# EAGLE design Serial_Controlled_Dual_Motor_Driver-v12 (EAGLE 7.2.0)
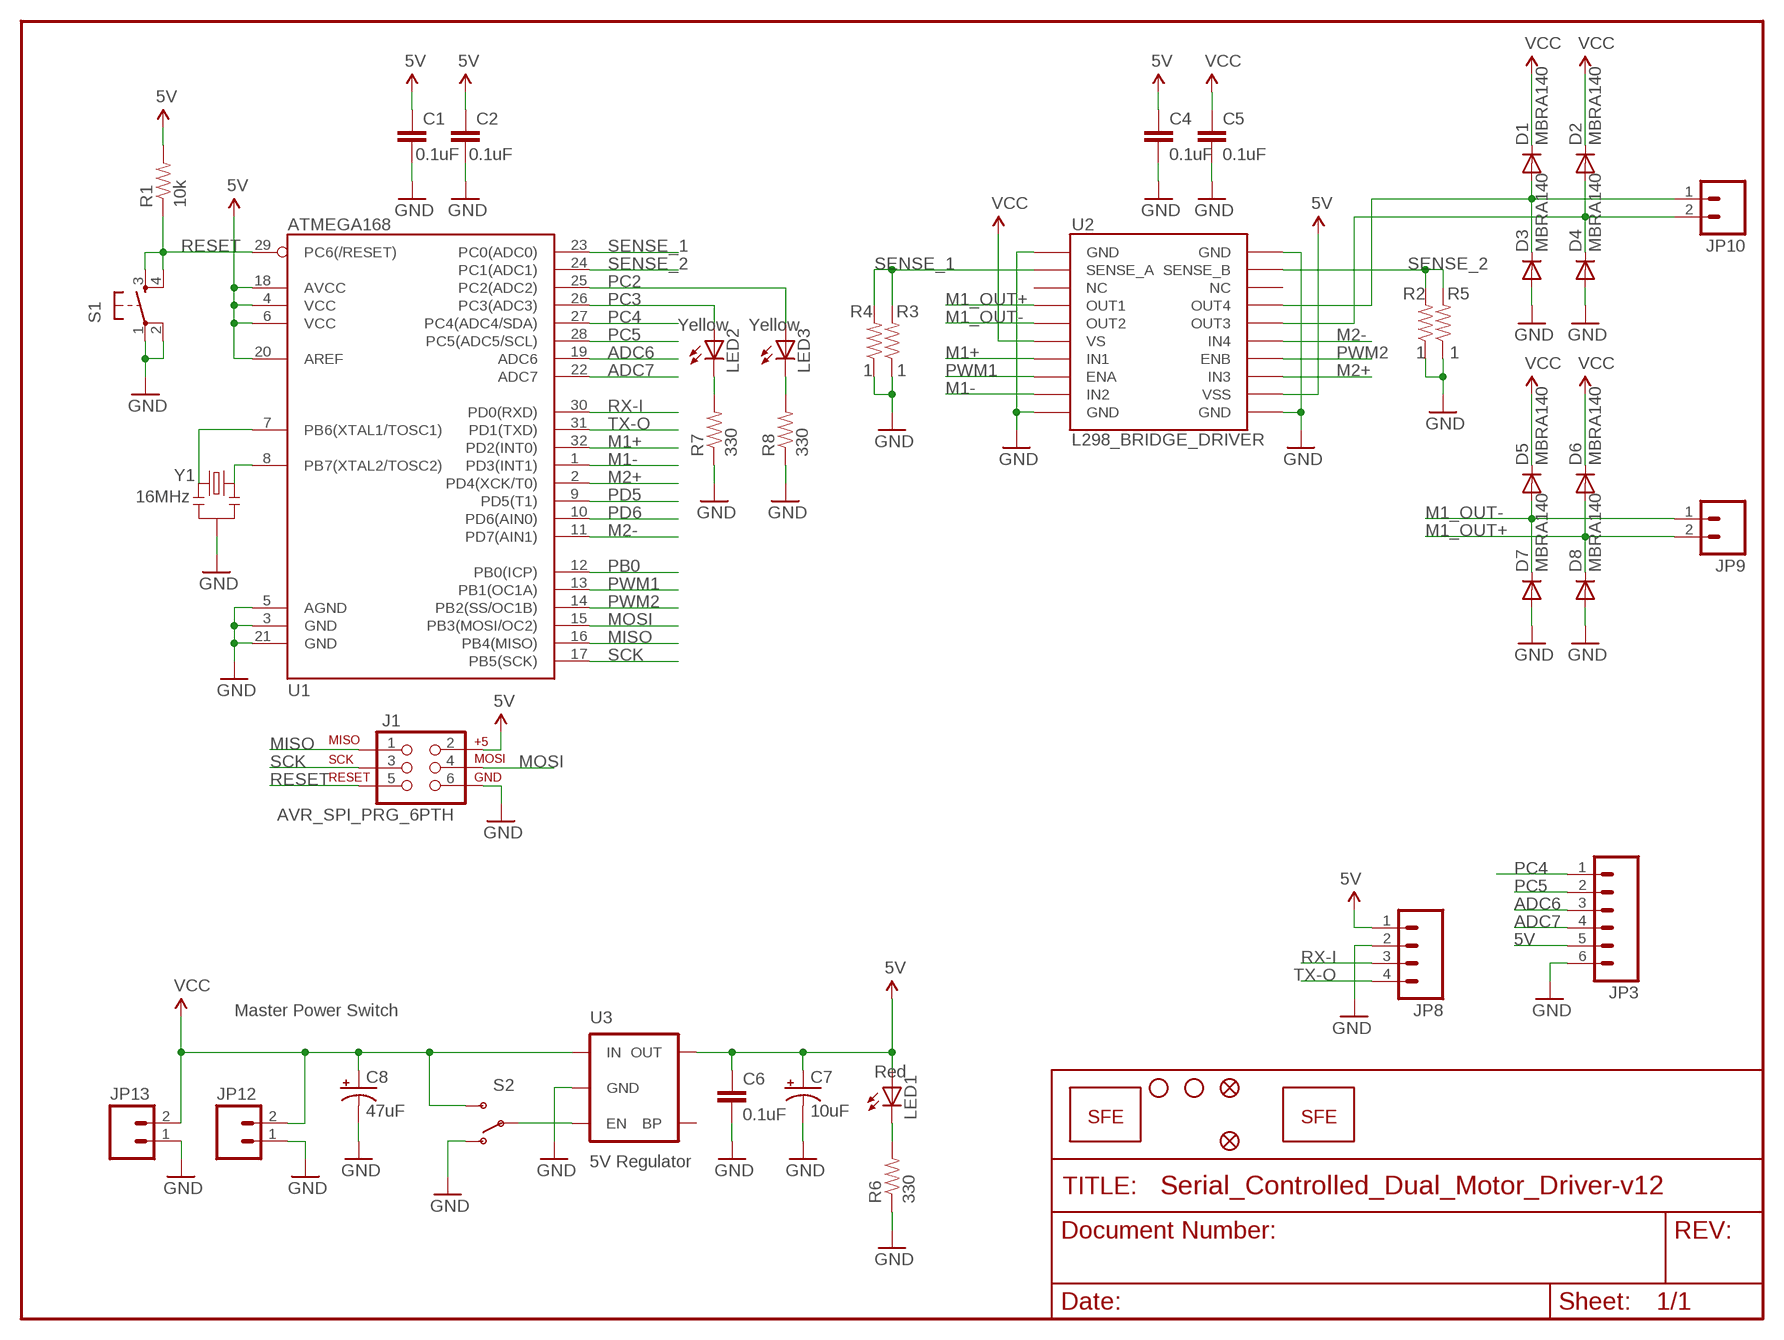
[diagram p0: schematic, sheet 1]

## Parts
C1  0.1uF  CAP0603-CAP  [0603-CAP]
C2  0.1uF  CAP0603-CAP  [0603-CAP]
C4  0.1uF  CAP0603-CAP  [0603-CAP]
C5  0.1uF  CAP0603-CAP  [0603-CAP]
C6  0.1uF  CAP0603-CAP  [0603-CAP]
C7  10uF  CAP_POL1206  [EIA3216]
C8  47uF  CAP_POL3528  [EIA3528]
D1  MBRA140  DIODESMA  [SMA-DIODE]
D2  MBRA140  DIODESMA  [SMA-DIODE]
D3  MBRA140  DIODESMA  [SMA-DIODE]
D4  MBRA140  DIODESMA  [SMA-DIODE]
D5  MBRA140  DIODESMA  [SMA-DIODE]
D6  MBRA140  DIODESMA  [SMA-DIODE]
D7  MBRA140  DIODESMA  [SMA-DIODE]
D8  MBRA140  DIODESMA  [SMA-DIODE]
J1  AVR_SPI_PRG_6PTH  [2X3]
JP1  LOGO-SFENEW  [SFE-NEW-WEBLOGO]
JP2  STAND-OFF  [STAND-OFF]
JP3  M06SIP  [1X06]
JP4  FIDUCIAL1X2  [FIDUCIAL-1X2]
JP5  FIDUCIAL1X2  [FIDUCIAL-1X2]
JP6  STAND-OFF  [STAND-OFF]
JP7  LOGO-SFESK  [SFE-LOGO-FLAME]
JP8  M04PTH  [1X04]
JP9  M02PTH  [1X02]
JP10  M02PTH  [1X02]
JP12  M02-JST-2MM-SMT  [S2B-PH]
JP13  M02PTH  [1X02]
LED1  Red  LED0603  [LED-0603]
LED2  Yellow  LED0603  [LED-0603]
LED3  Yellow  LED0603  [LED-0603]
R1  10k  RESISTOR0603-RES  [0603-RES]
R2  1  RESISTOR0603-RES  [0603-RES]
R3  1  RESISTOR0603-RES  [0603-RES]
R4  1  RESISTOR0603-RES  [0603-RES]
R5  1  RESISTOR0603-RES  [0603-RES]
R6  330  RESISTOR0603-RES  [0603-RES]
R7  330  RESISTOR0603-RES  [0603-RES]
R8  330  RESISTOR0603-RES  [0603-RES]
S1  TAC_SWITCHSMD  [TACTILE_SWITCH_SMD]
S2  SWITCH-SPSTSMD  [AYZ0202]
U1  ATMEGA168  [TQFP32-08]
U2  L298_BRIDGE_DRIVER  [POWERSO20]
U3  5V Regulator  V_REG_LDOSMD  [SOT23-5]
Y1  16MHz  RESONATORSMD  [RESONATOR-SMD]

## Nets
5V: C1.1 C2.1 C4.1 C6.1 C7.A(+) J1.2 JP3.5 JP8.1 LED1.A R1.2 U1.4(VCC) U1.6(VCC) U1.18(AVCC) U1.20(AREF) U2.P$12(VSS) U3.5(OUT)
ADC6: JP3.3 U1.19(ADC6)
ADC7: JP3.4 U1.22(ADC7)
GND: C1.2 C2.2 C4.2 C5.2 C6.2 C7.C(-) C8.C(-) D3.A D4.A D7.A D8.A J1.6 JP3.6 JP8.2 JP12.1 JP13.1 R2.1 R3.1 R4.1 R5.1 R6.1 R7.1 R8.1 S1.1 S1.2 S2.1(O) U1.3(GND) U1.5(AGND) U1.21(GND) U2.P$1(GND) U2.P$10(GND) U2.P$11(GND) U2.P$20(GND) U3.2(GND) Y1.2
M1+: U1.32(PD2(INT0)) U2.P$7(IN1)
M1-: U1.1(PD3(INT1)) U2.P$9(IN2)
M1_OUT+: D6.A D8.C JP9.2 U2.P$4(OUT1)
M1_OUT-: D5.A D7.C JP9.1 U2.P$5(OUT2)
M2+: U1.2(PD4(XCK/T0)) U2.P$13(IN3)
M2-: U1.11(PD7(AIN1)) U2.P$15(IN4)
M2_OUT+: D2.A D4.C JP10.2 U2.P$16(OUT3)
M2_OUT-: D1.A D3.C JP10.1 U2.P$17(OUT4)
MISO: J1.1 U1.16(PB4(MISO))
MOSI: J1.4 U1.15(PB3(MOSI/OC2))
N$1: S2.2(P) U3.3(EN)
N$2: U1.8(PB7(XTAL2/TOSC2)) Y1.3
N$3: U1.7(PB6(XTAL1/TOSC1)) Y1.1
N$4: LED2.C R7.2
N$7: LED3.C R8.2
N$97: LED1.C R6.2
PB0: U1.12(PB0(ICP))
PC2: LED3.A U1.25(PC2(ADC2))
PC3: LED2.A U1.26(PC3(ADC3))
PC4: JP3.1 U1.27(PC4(ADC4/SDA))
PC5: JP3.2 U1.28(PC5(ADC5/SCL))
PD5: U1.9(PD5(T1))
PD6: U1.10(PD6(AIN0))
PWM1: U1.13(PB1(OC1A)) U2.P$8(ENA)
PWM2: U1.14(PB2(SS/OC1B)) U2.P$14(ENB)
RESET: J1.5 R1.1 S1.3 S1.4 U1.29(PC6(/RESET))
RX-I: JP8.3 U1.30(PD0(RXD))
SCK: J1.3 U1.17(PB5(SCK))
SENSE_1: R3.2 R4.2 U1.23(PC0(ADC0)) U2.P$2(SENSE_A)
SENSE_2: R2.2 R5.2 U1.24(PC1(ADC1)) U2.P$19(SENSE_B)
TX-O: JP8.4 U1.31(PD1(TXD))
VCC: C5.1 C8.A(+) D1.C D2.C D5.C D6.C JP12.2 JP13.2 S2.3(S) U2.P$6(VS) U3.1(IN)
Unconnected: U2.P$3(NC) U2.P$18(NC) U3.4(BP)

## Notes on the sheet
- Master Power Switch

## Library data of the parts
C1 C2 C4-C6 = SparkFun:CAP: Capacitor Standard 0603 ceramic capacitor, and 0.1" leaded capacitor.
C7 C8 = SparkFun:CAP_POL: Capacitor Polarized These are standard SMD and PTH capacitors. Normally 10uF, 47uF, and 100uF in electrolytic and tantalum varieties. Always verify the external diameter of the through hole cap, it varies with capacity, voltage, and manufacturer. The EIA devices should be standard.
D1-D8 = SparkFun:DIODE: Diode These are standard reverse protection diodes and small signal diodes. SMA package can handle up to about 1A. SOD-323 can handle about 200mA. What the SOD-323 package when ordering, there are some mfgs out there that are 5-pin packages.
J1 = SparkFun:AVR_SPI_PRG_6: AVR ISP 6 Pin This is the reduced ISP connector for AVR programming. Common on Arduino. This footprint will take up less PCB space and can be used with a 10-pin to 6-pin adapter such as SKU: BOB-08508
JP1 JP7 = SparkFun:LOGO-SFE: Spark Fun Electronics PCB Logo This is the standard Spark Fun Electronics PCB logo.
JP2 JP6 = SparkFun:STAND-OFF: Stand Off This is the mechanical footprint for a #4 phillips button head screw. Use the keepout ring to avoid running the screw head into surrounding components. SKU : PRT-00447
JP3 = SparkFun:M06: Header 6 Standard 6-pin 0.1" header. Use with straight break away headers (SKU : PRT-00116), right angle break away headers (PRT-00553), swiss pins (PRT-00743), machine pins (PRT-00117), and female headers (PRT-00115). Molex polarized connector foot print use with SKU : PRT-08094 with associated crimp pins and housings. NOTES ON THE VARIANTS LOCK and LOCK_LONGPADS... This footprint was designed to help hold the alignment of a through-hole component (i.e. 6-pin header) while soldering it into place. You may notice that each hole has been shifted either up or down by 0.005 of an inch from it's more standard position (which is a perfectly straight line). This slight alteration caused the pins (the squares in the middle) to touch the edges of the holes. Because they are alternating, it causes a "brace" to hold the component in place. 0.005 has proven to be the perfect amount of "off-center" position when using our standard breakaway headers. Although looks a little odd when you look at the bare footprint, once you have a header in there, the alteration is very hard to notice. Also, if you push a header all the way into place, it is covered up entirely on the bottom side. This idea of altering the position of holes to aid alignment will be further integrated into the Sparkfun Library for other footprints. It can help hold any component with 3 or more connection pins.
JP4 JP5 = SparkFun:FIDUCIAL: Fiducial Alignment Points Various fiducial points for machine vision alignment.
JP8 = SparkFun:M04: Header 4 Standard 4-pin 0.1" header. Use with straight break away headers (SKU : PRT-00116), right angle break away headers (PRT-00553), swiss pins (PRT-00743), machine pins (PRT-00117), and female headers (PRT-00115). Molex polarized connector foot print use with SKU : PRT-08231 with associated crimp pins and housings.
JP9 JP10 JP12 JP13 = SparkFun:M02: Header 2 Standard 2-pin 0.1" header. Use with straight break away headers (SKU : PRT-00116), right angle break away headers (PRT-00553), swiss pins (PRT-00743), machine pins (PRT-00117), and female headers (PRT-00115). Molex polarized connector foot print use with SKU : PRT-08233 with associated crimp pins and housings.
LED1-LED3 = SparkFun:LED: LEDs Standard schematic elements and footprints for 5mm, 3mm, 1206, and 0603 sized LEDs. 5mm - Spark Fun Electronics SKU : COM-00529 (and others)
R1-R8 = SparkFun:RESISTOR: Resistor Basic schematic elements and footprints for 0603, 1206, and PTH 1/10th watt (small) resistors.
S1 = SparkFun:TAC_SWITCH: Momentary Switch Button commonly used for reset or general input. Spark Fun Electronics SKU : COM-00097
S2 = SparkFun:SWITCH-SPST: SPST Switch Simple slide switch. Spark Fun Electronics SKU : COM-00102
U1 = SparkFun:ATMEGA168
U2 = SparkFun:L298_BRIDGE_DRIVER
U3 = SparkFun:V_REG_LDO: Voltage Regulator LDO Standard 150mA LDO voltage regulator in SOT-23 layout. Micrel part MIC5205. BP (by-pass) pin is used to lower output noise with 470pF cap.
Y1 = SparkFun:RESONATOR: Resonator Small SMD resonator. This is the itty bitty 10/20MHz resonators with built in caps. CSTCE10M0G55 and CSTCE20M0V53. Footprint has been reviewed closely but hasn't been tested yet.

## Board
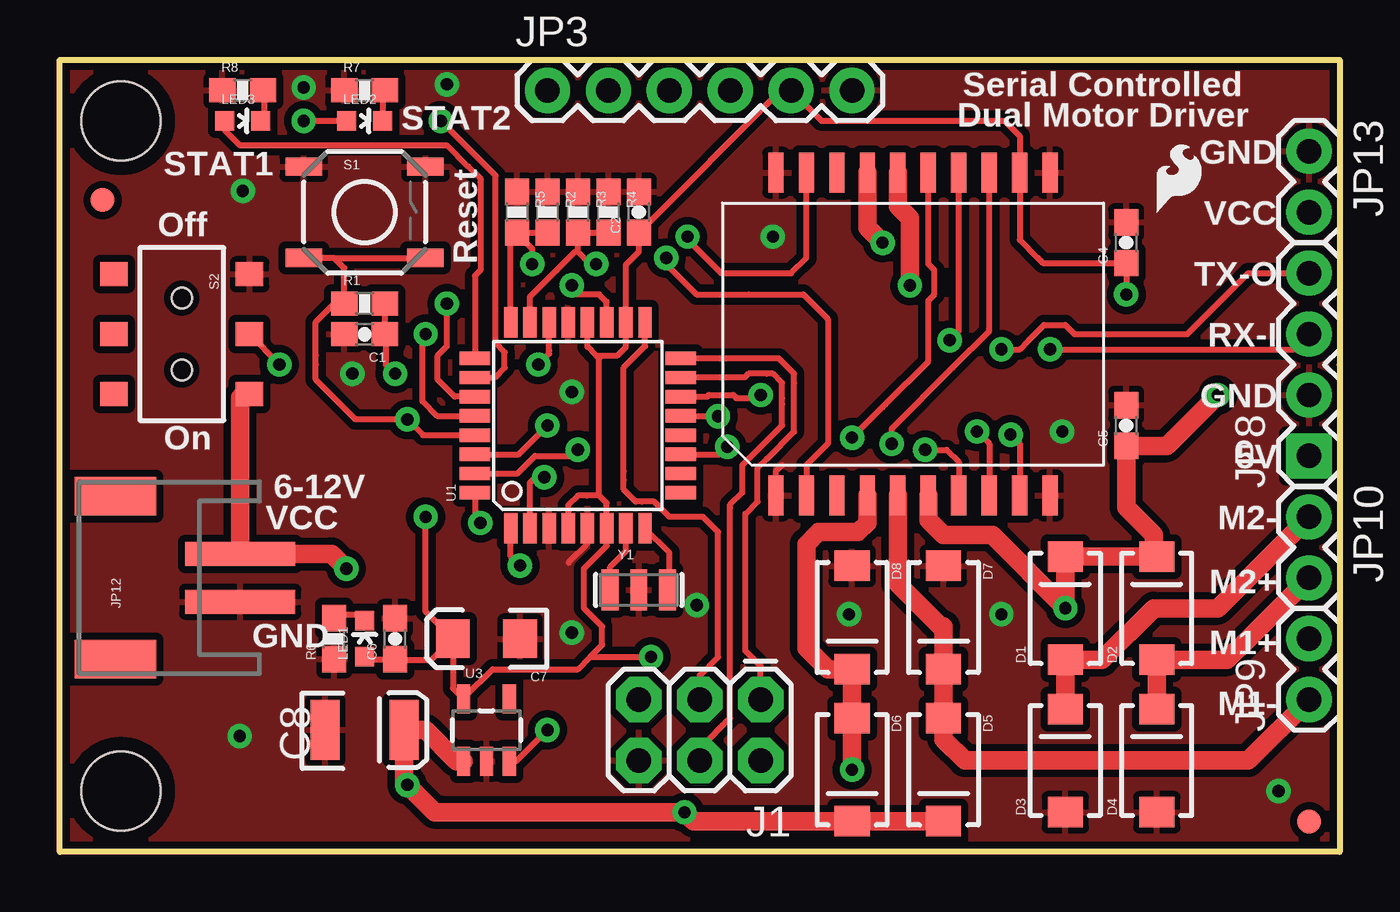
[diagram p1: board, top side]
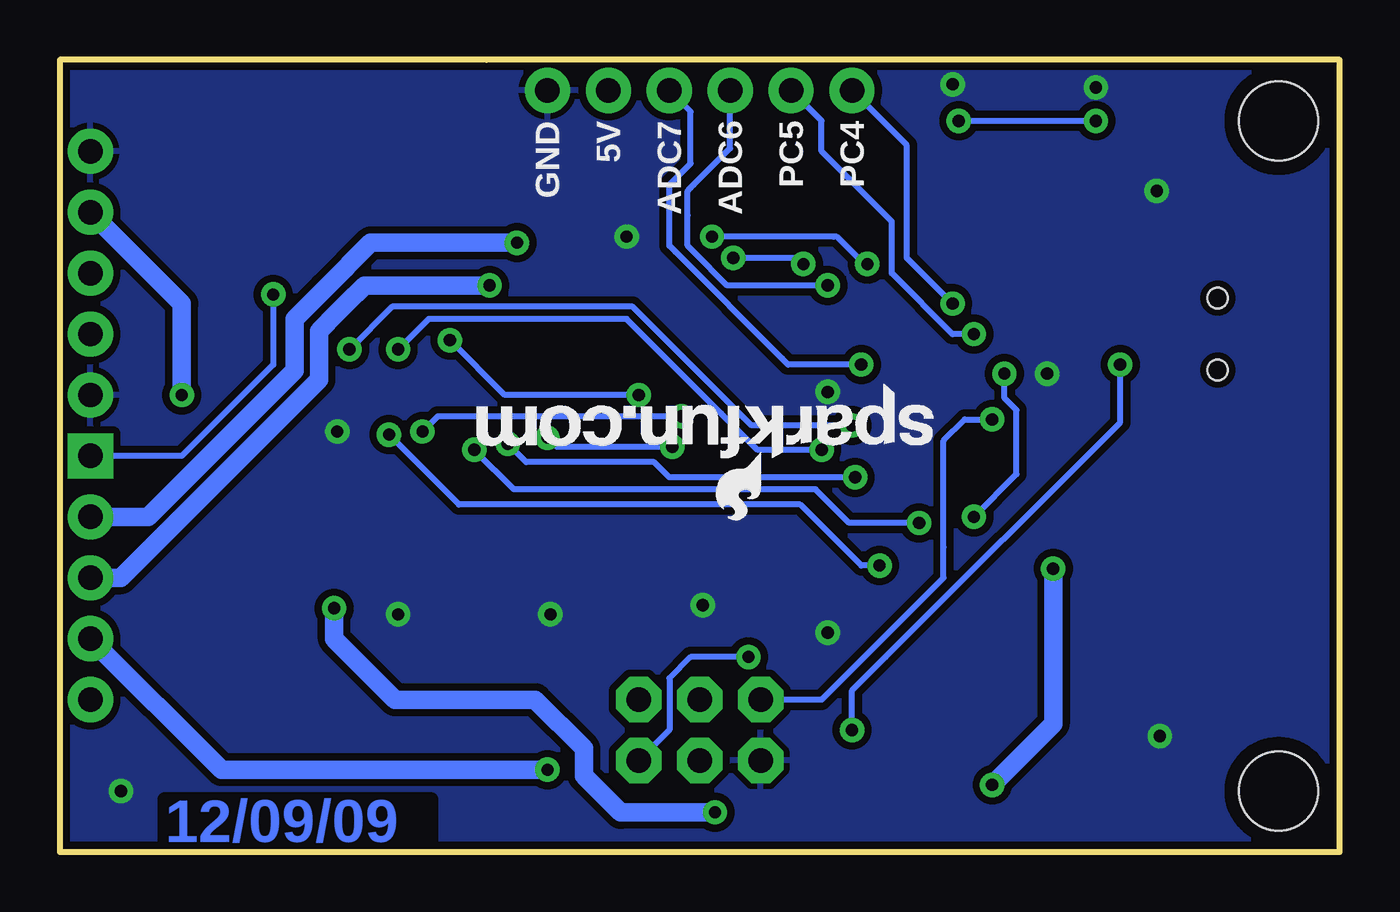
[diagram p2: board, bottom side, seen from below]

Size 53.34 x 33.02 mm. Coordinates in mm from the lower left corner, seen from the top.
Outline: 0,0 0,33.02 35.56,33.02 53.34,33.02 53.34,20.32 53.34,0 0,0
Copper layers (1*16): Top 0.035mm / dielectric 1.5mm / Bottom 0.035mm
Design rules "SparkFun *": minimum track width 8mil, minimum drill 20mil, track to track 8mil, track to pad 8mil, pad to pad 8mil, via to via 8mil, smd to smd 8mil, copper to edge 9mil, drill to drill 8mil, minimum pad ring 12mil, minimum via ring 10mil, stop-mask expansion 4mil, vias tented up to drill 20mil, thermal gap 10mil

### Footprints (pad centres in the part's own frame; a part is rotated, then mirrored left to right if it is on the bottom)
0603-CAP = smd 1.1 x 1: 1 -0.85,0; 2 0.85,0
EIA3216 = smd 1.4 x 1.6: A 1.4,0; C -1.4,0
EIA3528 = smd 1.2 x 2.5: A 1.65,0; C -1.65,0
SMA-DIODE = smd 1.27 x 1.47: A -2.15,0; C 2.15,0
2X3 = drill 1.016 pad 1.88 octagon: 1 0,0; 2 0,2.54; 3 2.54,0; 4 2.54,2.54; 5 5.08,0; 6 5.08,2.54
STAND-OFF = hole 3.302: 0,0
1X06 = drill 1.016 pad 1.88: 1 0,0; 2 2.54,0; 3 5.08,0; 4 7.62,0; 5 10.16,0; 6 12.7,0
FIDUCIAL-1X2 = smd 1 x 1: 1 0,0
1X04 = drill 1.016 pad 1.88 square: 1 0,0 | drill 1.016 pad 1.88: 2 2.54,0; 3 5.08,0; 4 7.62,0
1X02 = drill 1.016 pad 1.88: 1 0,0; 2 2.54,0
S2B-PH = smd 1 x 4.6: 1 -1,-3.7; 2 1,-3.7 | smd 1.6 x 3.4: NC1 -3.4,1.5; NC2 3.4,1.5
LED-0603 = smd 0.8 x 0.8: A 0,-0.75; C 0,0.75
0603-RES = smd 1.1 x 1: 1 -0.85,0; 2 0.85,0
TACTILE_SWITCH_SMD = smd 1.524 x 0.762: 1 -2.54,1.905; 2 2.54,1.905; 3 -2.54,-1.905; 4 2.54,-1.905
AYZ0202 = smd 1 x 1.15: 1 -2.5,2.825; 2 0,2.825; 3 2.5,2.825; 4 -2.5,-2.825; 5 0,-2.825; 6 2.5,-2.825 | hole 0.85: 1.5,0; -1.5,0
TQFP32-08 = smd 1.27 x 0.559: 1 -4.293,2.8; 2 -4.293,2; 3 -4.293,1.2; 4 -4.293,0.4; 5 -4.293,-0.4; 6 -4.293,-1.2; 7 -4.293,-2; 8 -4.293,-2.8; 17 4.293,-2.8; 18 4.293,-2; 19 4.293,-1.2; 20 4.293,-0.4; 21 4.293,0.4; 22 4.293,1.2; 23 4.293,2; 24 4.293,2.8 | smd 0.559 x 1.27: 9 -2.8,-4.293; 10 -2,-4.293; 11 -1.2,-4.293; 12 -0.4,-4.293; 13 0.4,-4.293; 14 1.2,-4.293; 15 2,-4.293; 16 2.8,-4.293; 25 2.8,4.293; 26 2,4.293; 27 1.2,4.293; 28 0.4,4.293; 29 -0.4,4.293; 30 -1.2,4.293; 31 -2,4.293; 32 -2.8,4.293
POWERSO20 = smd 1.651 x 0.635: P$1 -6.731,5.715; P$2 -6.731,4.445; P$3 -6.731,3.175; P$4 -6.731,1.905; P$5 -6.731,0.635; P$6 -6.731,-0.635; P$7 -6.731,-1.905; P$8 -6.731,-3.175; P$9 -6.731,-4.445; P$10 -6.731,-5.715; P$11 6.731,-5.715; P$12 6.731,-4.445; P$13 6.731,-3.175; P$14 6.731,-1.905; P$15 6.731,-0.635; P$16 6.731,0.635; P$17 6.731,1.905; P$18 6.731,3.175; P$19 6.731,4.445; P$20 6.731,5.715
SOT23-5 = smd 0.55 x 1.2: 1 -0.95,-1.3; 2 0,-1.3; 3 0.95,-1.3; 4 0.95,1.3; 5 -0.95,1.3
RESONATOR-SMD = smd 0.7 x 1.7: 1 -1.2,0; 2 0,0; 3 1.2,0

### Placement (x,y rotation side)
C1  12.7,21.59 180 top
C2  24.13,26.67 90 top
C4  44.45,25.4 90 top
C5  44.45,17.78 90 top
C6  13.97,8.89 90 top
C7  17.78,8.89 180 top
C8  12.7,5.08 0 top
D1  41.91,10.16 90 top
D2  45.72,10.16 90 top
D3  41.91,3.81 90 top
D4  45.72,3.81 90 top
D5  36.83,3.43 270 top
D6  33.02,3.43 270 top
D7  36.83,9.78 270 top
D8  33.02,9.78 270 top
J1  29.21,6.35 180 top
JP1  16.92,19.53 180 bottom
JP2  2.54,30.48 0 top
JP3  20.32,31.75 0 top
JP4  52.07,1.27 0 top
JP5  1.78,27.18 0 top
JP6  2.54,2.54 0 top
JP7  45.72,26.67 0 top
JP8  52.07,16.51 90 top
JP9  52.07,6.35 90 top
JP10  52.07,13.97 270 top
JP12  3.81,11.43 90 top
JP13  52.07,29.21 270 top
LED1  12.7,8.89 0 top
LED2  12.7,30.48 270 top
LED3  7.62,30.48 270 top
R1  12.7,22.86 0 top
R2  20.32,26.67 270 top
R3  21.59,26.67 270 top
R4  22.86,26.67 270 top
R5  19.05,26.67 270 top
R6  11.43,8.89 90 top
R7  12.7,31.75 0 top
R8  7.62,31.75 0 top
S1  12.7,26.67 0 top
S2  5.08,21.59 270 top
U1  21.59,17.78 90 top
U2  35.56,21.59 90 top
U3  17.78,5.08 0 top
Y1  24.13,10.92 0 top

### Tracks (layer width: path | path; a pad name or v marks a point on that pad's centre or on a via)
5V  (via drill 0.51)
  Top 0.254: C7.A 15.49,8 13.97,8 C6.1 13.93,8 13.84,8 12.84,8 LED1.A | C7.A 16.38,9.02 C7.A | C7.A 16.38,6.83 U3.5 16.83,6.42 16.89,6.48 18.03,7.62 21.59,7.62 22.1,8.13 | U1.4 21.19,14.46 21.59,14.86 21.97,14.86 22.48,14.86 | 22.48,14.86 22.79,14.55 U1.6 22.79,12.76 21.84,11.81 21.84,10.29 21.84,10.16 22.35,9.65 22.61,9.4 22.61,8.64 22.1,8.13 | U1.20 21.99,21.06 22.35,20.7 | 22.35,20.7 23.24,20.7 23.59,21.05 U1.18 23.59,24.48 24.13,25.02 24.13,25.15 C2.1 30.06,31.75 JP3.5 31.75,30.48 39.37,30.48 40.01,29.84 U2.P$12 40.01,25.53 40.77,24.77 40.89,24.64 40.98,24.55 C4.1 v44.45,23.24 | 22.48,14.86 22.48,20.57 22.35,20.7 | v24.64,8.13 24.38,8.13 22.1,8.13 | 13.59,21.59 C1.1 | R1.2 13.55,21.63 13.59,21.59 | 13.59,21.59 13.59,20.32 v13.97,19.94 | C7.A | v15.24,13.97 15.24,10.03 C7.A
  Bottom 0.254: v13.97,19.94 13.97,18.92 13.46,18.41 13.46,15.75 v15.24,13.97 | JP8.1 48.26,16.51 47.37,17.4 44.45,20.32 v44.45,23.24 | v24.64,8.13 27.05,8.13 27.94,7.24 27.94,5.08 J1.2
ADC6  (via drill 0.51)
  Top 0.254: U1.19 22.79,22.93 22.48,23.24 21.46,23.24 21.34,23.37 v21.34,23.62
  Bottom 0.254: v21.34,23.62 25.27,23.62 25.53,23.62 26.92,25.02 27.18,25.27 27.18,26.54 27.18,27.56 27.05,27.69 26.92,27.81 25.4,29.34 JP3.3
ADC7  (via drill 0.51)
  Top 0.254: U1.22 20.39,20.88 20.39,20.77 v19.94,20.32
  Bottom 0.254: JP3.4 27.05,30.86 27.05,28.7 27.94,27.81 27.94,25.27 27.69,25.02 23.24,20.57 22.99,20.32 v19.94,20.32
GND  (via drill 0.51)
  Top 0.254: U1.5 21.99,12.85 21.21,12.07 | U2.P$1 29.84,15.88 30.1,16.13
  other vias: 26.54,10.29 21.34,9.14 10.16,31.88 16.13,32 12.19,19.94 7.62,27.56 29.72,25.65 21.34,19.18 50.8,2.54 41.78,17.53 32.89,9.91 39.24,9.91 7.49,4.83
  pour Bottom (isolate 0.305): 0,0 0,33.02 53.34,33.02 53.34,0
  pour Top (isolate 0.305): 0,0 0,33.02 53.34,33.02 53.34,0
M1+  (via drill 0.51)
  Top 0.254: U1.32 17.3,13.95 v17.53,13.72 | U2.P$7 37.47,16.26 36.96,16.76 v36.07,16.76
  Bottom 0.254: v17.53,13.72 20.45,13.72 21.84,15.11 34.42,15.11 v36.07,16.76
M1-  (via drill 0.51)
  Top 0.254: U1.1 18.79,12.32 v19.18,11.94 | U2.P$9 40.01,17.02 v39.62,17.4
  Bottom 0.254: v19.18,11.94 19.94,11.94 22.48,14.48 36.7,14.48 v39.62,17.4
M1_OUT+  (via drill 0.51)
  Top 0.762: v33.02,3.43 33.02,5.21 D6.A 33.02,5.84 D8.C 33.27,7.63 33.27,7.62 32,7.62 31.11,8.51 31.11,8.76 31.11,9.27 31.11,12.83 31.62,13.34 33.27,13.34 33.66,13.72 U2.P$4
  Bottom 0.762: v33.02,3.43 33.15,3.43 46.61,3.43 JP9.2
M1_OUT-
  Top 0.762: JP9.1 49.53,3.81 38.1,3.81 37.97,3.81 37.72,3.81 36.83,4.7 D5.A 36.83,5.84 D7.C 36.83,9.4 36.7,9.4 36.45,9.65 34.92,11.18 U2.P$5
M2+  (via drill 0.51)
  Top 0.254: U1.2 19.59,14.64 19.59,15.4 19.81,15.62 | 19.81,15.62 v20.19,15.62 19.81,15.62 | U2.P$13 38.73,22.1 38.73,21.72 37.21,20.19 34.67,17.65 v34.67,17.02
  Bottom 0.254: v20.19,15.62 27.94,15.62 28.57,16.26 33.91,16.26 v34.67,17.02
M2-  (via drill 0.51)
  Top 0.254: U2.P$15 36.2,24.77 36.2,24.51 36.45,24.26 36.45,23.24 36.2,22.99 36.2,20.45 34.42,18.67 34.29,18.54 v33.02,17.27 | U1.11 27.5,16.58 v27.81,16.89
  Bottom 0.254: v27.81,16.89 32.64,16.89 v33.02,17.27
M2_OUT+  (via drill 0.51)
  Top 0.762: D4.C D2.A 48.65,8.01 49.53,8.89 JP10.2 | U2.P$16 34.92,26.92 35.43,26.42 v35.43,23.62
  Bottom 0.762: JP10.2 50.8,11.43 46.74,15.49 42.55,19.68 42.55,20.83 42.55,21.72 41.78,22.48 41.53,22.73 41.4,22.86 40.64,23.62 v35.43,23.62
M2_OUT-  (via drill 0.51)
  Top 0.762: D3.C 41.91,6.22 D1.A 42.41,8.01 42.42,8 43.43,8 45.59,10.16 48.26,10.16 49.53,11.43 JP10.1 | U2.P$17 33.66,26.04 v34.29,25.4
  Bottom 0.762: v34.29,25.4 40.39,25.4 42.29,23.49 43.56,22.22 43.56,21.46 43.56,20.07 44.07,19.56 49.66,13.97 JP10.1
MISO
  Top 0.254: J1.1 29.21,7.75 28.57,8.38 28.57,14.1 29.08,14.61 29.08,16 29.46,16.38 30.61,17.53 30.61,19.56 30.61,19.94 29.97,20.58 27.43,20.58 U1.16
MOSI
  Top 0.254: J1.4 26.67,4.32 27.94,5.59 27.94,14.35 27.94,14.48 28.45,14.99 28.45,16.13 29.08,16.76 29.21,16.89 30.1,17.78 30.1,18.67 30.1,18.92 30.1,19.56 29.72,19.94 29.46,19.94 28.7,19.94 28.54,19.78 27.46,19.78 U1.15
N$1  (via drill 0.51)
  Top 0.254: U3.3 19.02,3.78 v20.32,5.08 | S2.2 9.14,20.35 v9.14,20.32
  Bottom 0.254: v20.32,5.08 20.32,6.73 18.92,8.13 9.14,17.91 v9.14,20.32
N$2
  Top 0.254: U1.8 25.4,12.48 25.4,12.45 25.4,12.32 25.4,10.99 Y1.3
N$3
  Top 0.254: U1.7 23.59,12.54 23.11,12.07 22.93,11.88 Y1.1
N$4
  Top 0.254: R7.2 13.72,31.75 13.45,31.48 LED2.C
N$7
  Top 0.254: R8.2 8.51,31.71 8.51,31.62 8.51,30.62 LED3.C
N$97
  Top 0.254: R6.2 11.56,9.87 11.56,9.91 12.43,9.91 LED1.C
PC2
  Top 0.254: U1.25 17.3,24.03 17.53,24.26 17.53,25.27 17.53,27.94 17.53,28.07 17.02,28.57 16.13,29.46 16,29.46 15.49,29.46 15.37,29.46 11.81,29.46 7.49,29.46 6.99,29.97 6.87,30.09 LED3.A
PC3  (via drill 0.51)
  Top 0.254: U1.26 18.13,19.78 18.54,20.19 18.54,20.83 18.16,21.21 18.16,28.19 v15.88,30.48 | v10.16,30.48 LED2.A
  Bottom 0.254: v15.88,30.48 v10.16,30.48
PC4  (via drill 0.51)
  Top 0.254: U1.27 16.45,18.98 15.75,19.68 15.75,20.7 16.13,21.08 v16.13,22.86
  Bottom 0.254: v16.13,22.86 18.03,24.77 18.03,25.15 18.03,29.46 JP3.1
PC5  (via drill 0.51)
  Top 0.254: U1.28 15.73,18.18 15.11,18.8 15.11,21.46 v15.24,21.59
  Bottom 0.254: v15.24,21.59 16.13,21.59 18.67,24.13 18.67,26.29 21.59,29.21 21.59,30.48 JP3.2
PWM1  (via drill 0.51)
  Top 0.254: U1.13 27.41,18.18 v27.43,18.16 | U2.P$8 38.73,17.02 v38.23,17.53
  Bottom 0.254: v27.43,18.16 37.59,18.16 v38.23,17.53
PWM2  (via drill 0.51)
  Top 0.254: U1.14 26.98,18.98 27.05,19.05 28.07,19.05 28.19,18.92 29.08,18.92 v29.21,19.05 | U2.P$14 37.47,24 37.47,21.72 v37.08,21.34
  Bottom 0.254: v29.21,19.05 32.51,19.05 32.89,19.05 34.8,19.05 v37.08,21.34
RESET  (via drill 0.51)
  Top 0.254: U1.29 15.13,17.38 v14.48,18.03 12.32,18.03 10.67,19.68 10.67,20.32 10.67,20.7 10.67,22.1 11.43,22.86 11.94,22.86 | 11.94,22.86 R1.1 | 11.94,22.86 R1.1 | 11.94,22.86 R1.1 | S1.3 10.54,24.77 11.43,24.77 | 11.43,24.77 S1.4 | 11.94,22.86 R1.1 | R1.1 11.85,24.34 11.43,24.77
  Bottom 0.254: v14.48,18.03 15.62,18.03 16.51,17.14 16.51,12.7 16.51,11.43 21.59,6.35 J1.5
RX-I  (via drill 0.51)
  Top 0.254: U1.30 19.12,16.58 v20.32,17.78 | v41.27,20.95 51.44,20.95 JP8.3
  Bottom 0.254: v20.32,17.78 24.51,17.78 26.16,19.43 29.46,22.73 39.5,22.73 v41.27,20.95
SCK
  Top 0.254: U1.17 24.39,21.09 23.5,20.19 23.5,15.88 23.5,15.49 23.5,15.11 24,14.61 24.26,14.61 24.77,14.61 25.4,13.97 26.8,13.97 27.43,13.34 27.43,8.13 26.67,7.37 J1.3
SENSE_1  (via drill 0.51)
  Top 0.254: U1.23 19.59,23.02 19.59,23.15 20.7,24.26 21.46,25.02 21.59,25.02 | 21.59,25.02 21.59,25.65 R3.2 21.68,25.82 21.72,25.78 21.76,25.82 R4.2 | v22.35,24.51 22.1,24.51 21.59,25.02 | U2.P$2 31.11,16.13 32,17.02 32,22.22 30.99,23.24 28.7,23.24 26.54,23.24 25.27,24.51 v25.27,24.77
  Bottom 0.254: 22.61,24.77 v22.35,24.51 22.61,24.77 | 22.61,24.77 v25.27,24.77
SENSE_2  (via drill 0.51)
  Top 0.254: 19.05,25.78 R5.2 | U1.24 18.79,25.52 19.05,25.78 | R2.2 20.32,25.78 20.28,25.82 R5.2 | 19.05,25.78 R5.2 | v19.68,24.51 19.68,25.15 19.05,25.78 | U2.P$19 31.11,24.77 30.48,24.13 27.56,24.13 26.29,25.4 26.16,25.53 v26.16,25.65
  Bottom 0.254: v19.68,24.51 19.81,24.51 20.95,25.65 21.08,25.65 v26.16,25.65
TX-O  (via drill 0.51)
  Top 0.254: U1.31 19.08,15.78 19.81,16.51 21.34,16.51 v21.59,16.76 | v39.24,20.95 40.01,20.95 40.39,21.34 40.51,21.46 41.02,21.97 41.91,21.97 42.29,21.59 45.72,21.59 46.99,21.59 48.26,22.86 49.53,24.13 JP8.4
  Bottom 0.254: v21.59,16.76 24.26,16.76 25.78,18.29 29.72,22.22 30.86,22.22 37.97,22.22 v39.24,20.95
VCC  (via drill 0.51)
  Top 0.254: D2.C | D1.C
  Top 0.762: U3.1 16.54,3.78 15.24,5.08 14.48,5.08 C8.A 14.35,2.92 v14.48,2.79 15.61,1.66 15.87,1.66 15.88,1.65 | D6.C | D6.C D5.C | 45.59,12.32 45.6,12.31 D2.C | D1.C 45.58,12.31 45.59,12.32 | 42.04,12.45 D1.C | D1.C 41.91,11.43 v41.91,10.16 | 15.88,1.65 15.88,1.66 | S2.3 7.66,19.09 7.62,19.05 7.51,18.94 JP12.2 11.32,12.43 v11.94,11.81 | v48.26,19.05 46.14,16.93 C5.1 44.45,14.86 44.45,14.35 45.59,13.21 45.59,12.32 | U2.P$6 36.2,13.84 36.45,13.59 36.58,13.46 36.83,13.21 37.34,13.21 38.86,13.21 v41.91,10.16 | v41.91,10.16 41.78,10.16 | 15.88,1.65 16.38,1.65 v26.04,1.65 26.41,1.28 D6.C
  Bottom 0.762: v41.91,10.16 41.91,8.89 39.37,6.35 33.53,6.35 31.5,4.32 31.5,3.17 29.97,1.65 v26.04,1.65 | v48.26,19.05 48.26,22.86 JP13.2 | v11.94,11.81 11.94,5.33 v14.48,2.79

### Text on the board
Bottom: 12/09/09
tPlace: Serial Controlled | Dual Motor Driver | STAT2 | GND | STAT1 | VCC | Off | Reset | TX-O | RX-I | GND | On | 5V | 6-12V | VCC | M2- | M2+ | M1+ | GND | M1-
bPlace: PC4 | PC5 | ADC6 | ADC7 | 5V | GND